# EAGLE schematic EE-Workshop (EAGLE 9.4.0)
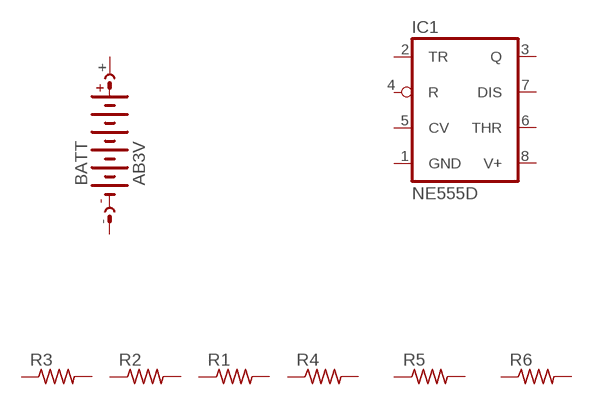
[diagram p0: schematic, sheet 1]

## Parts
BATT  AB3V  AB9V  [AB9V]
IC1  NE555D  [SO08]
R1  R-US_R0805  [R0805]
R2  R-US_R0805  [R0805]
R3  R-US_R0805  [R0805]
R4  R-US_R0805  [R0805]
R5  R-US_R0805  [R0805]
R6  R-US_R0805  [R0805]
Unconnected: BATT.+ BATT.- IC1.2(TR) IC1.3(Q) IC1.4(R) IC1.5(CV) IC1.6(THR) IC1.7(DIS) R1.1 R1.2 R2.1 R2.2 R3.1 R3.2 R4.1 R4.2 R5.1 R5.2 R6.1 R6.2

## Power pins joined to a net without a drawn wire
GND: IC1.1(GND)
V+: IC1.8(V+)

## Library data of the parts
BATT = battery:AB9V: 9-V BATTERY CLIP
IC1 = linear:*555: TIMER
R1-R6 = rcl:R-US_: RESISTOR, American symbol; SPICEPREFIX: R